# Altium schematic sheet Sheet2.SchDoc
size A4
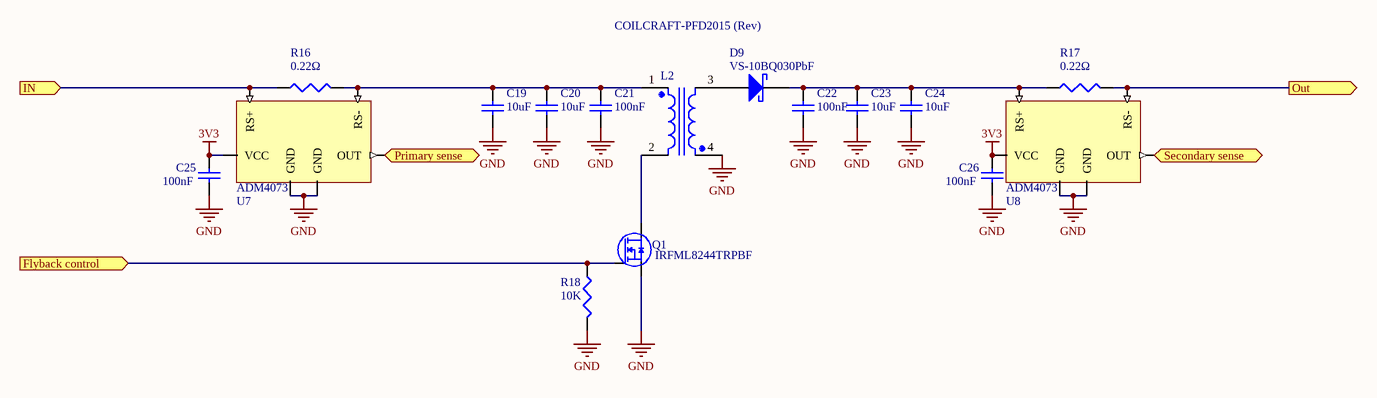
[diagram p0: Sheet2.SchDoc]

## Parts
C19  value 10uF  [6-0805_M]  (hidden comment: Cap Semi)
C20  value 10uF  [6-0805_M]  (hidden comment: Cap Semi)
C21  value 100nF  [1608[0603]]  (hidden comment: Cap Semi)
C22  value 100nF  [1608[0603]]  (hidden comment: Cap Semi)
C23  value 10uF  [6-0805_M]  (hidden comment: Cap Semi)
C24  value 10uF  [6-0805_M]  (hidden comment: Cap Semi)
C25  value 100nF  [1608[0603]]  (hidden comment: Cap Semi)
C26  value 100nF  [1608[0603]]  (hidden comment: Cap Semi)
D9  VS-10BQ030PbF  [VS-10BQ030PbF - DIOM4435X24N]
L2  COILCRAFT-PFD2015 (Rev)  [PFD2015]
Q1  IRFML8244TRPBF  [SOT95P237X112-3N]
R16  value 0.22Ω  [RESC6332]  (hidden comment: Res3)
R17  value 0.22Ω  [RESC6332]  (hidden comment: Res3)
R18  value 10K  [J1-0603]  (hidden comment: Res3)
U7  ADM4073  [ADM4073 - SOT95P280X145-6N]
U8  ADM4073  [ADM4073 - SOT95P280X145-6N]

## Ports
Flyback control (in), IN (in), Out (out), Primary sense (out), Secondary sense (out)

## Nets
3V3: C25.2 C26.2 U7.3(VCC) U8.3(VCC)
GND: C19.1 C20.1 C21.1 C22.1 C23.1 C24.1 C25.1 C26.1 L2.4 Q1.2(S) R18.2 U7.1(GND) U7.2(GND) U8.1(GND) U8.2(GND)
Flyback control: Q1.1(G) R18.1 ; port Flyback control
IN: R16.1 U7.4(RS+) ; port IN
Out: R17.2 U8.5(RS-) ; port Out
Primary sense: U7.6(OUT) ; port Primary sense
Secondary sense: U8.6(OUT) ; port Secondary sense
NetC19_2: C19.2 C20.2 C21.2 L2.1 R16.2 U7.5(RS-)
NetC22_2: C22.2 C23.2 C24.2 D9.1 R17.1 U8.4(RS+)
NetD9_2: D9.2 L2.3
NetL2_2: L2.2 Q1.3(D)

## Library data of the parts
C19-C26 = Cap Semi: Capacitor (Semiconductor SIM Model); Published: 8-Jun-2000; LatestRevisionDate: 29-May-2009; LatestRevisionNote: IPC-7351 Footprint Added.; PackageReference: C1206; Publisher: Altium Limited; PackageDescription: Chip Capacitor
Q1 = IRFML8244TRPBF: INTERNATIONAL RECTIFIER - IRFML8244TRPBF - N CH MOSFET, 25V, 5.8A, 3-SOT-23, FULL REEL; Transistor Polarity: N Channel; Continuous Drain Current Id: 5.8; Drain Source Voltage Vds: 25; On Resistance Rds(on): 20; Rds(on) Test Voltage Vgs: 10; Threshold Voltage Vgs: 1.7; Supplier 1: Farnell; Manufacturer: INTERNATIONAL RECTIFIER; Manufacturer Part Number: IRFML8244TRPBF; RoHS: YES; Pricing 1: 3000=0.24, 6000=0.22, 9000=0.21 (EUR); ComponentLink1URL: http://www.irf.com/product-info/datasheets/data/irfml8244pbf.pdf; ComponentLink1Description: http://www.irf.com/product-info/datasheets/data/irfml8244pbf.pdf
R16-R18 = Res3: Resistor; Published: 8-Jun-2000; LatestRevisionDate: 29-May-2009; LatestRevisionNote: IPC-7351 Footprint Added.; PackageReference: J1-0603; Publisher: Altium Limited; PackageDescription: Chip Resistor
L2 = COILCRAFT-PFD2015 (Rev): Inductance@0A: *; Inductance@IpkA: *